# EAGLE design 608_donkey_205 (EAGLE 9.6.2)
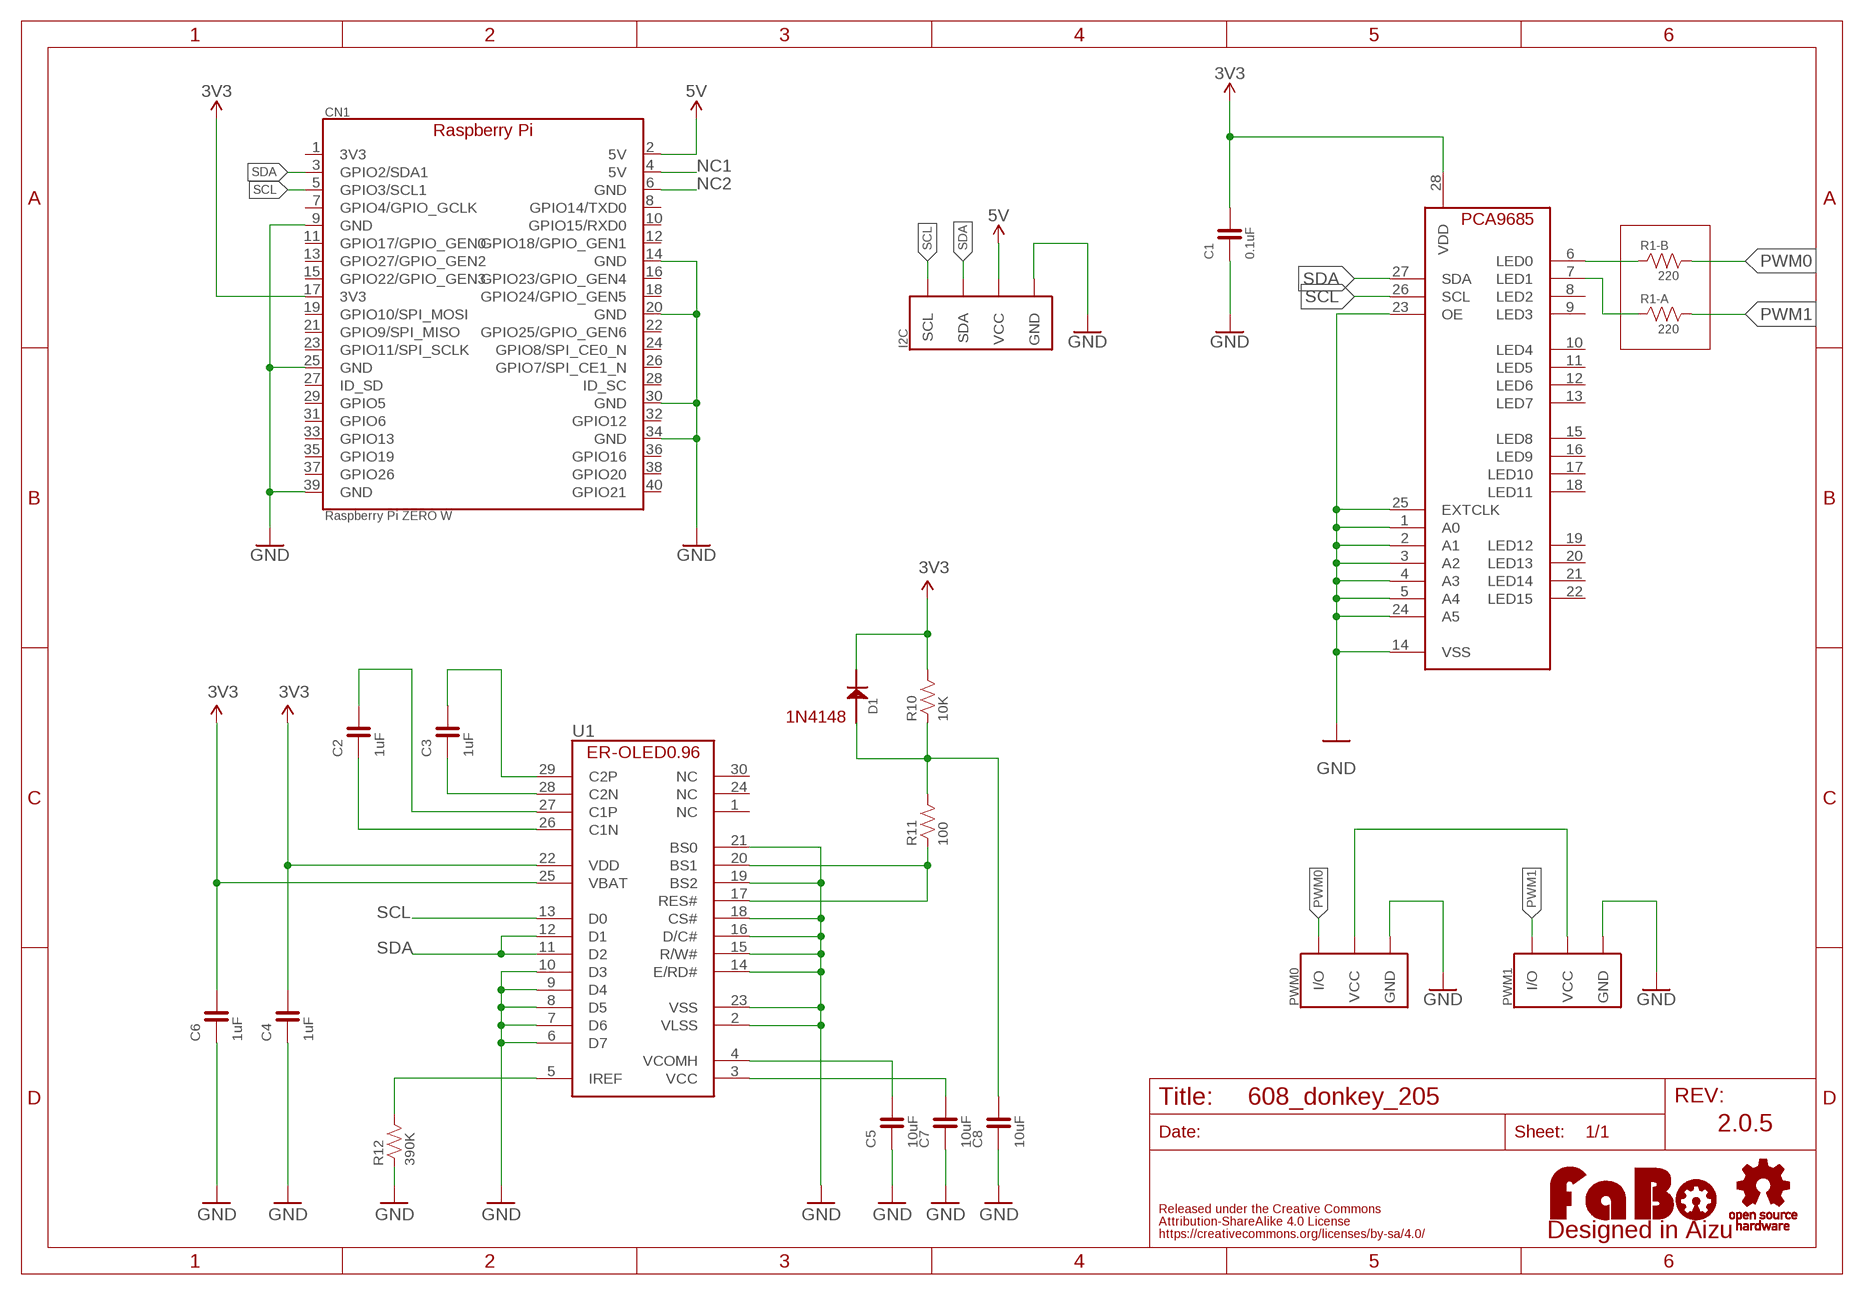
[diagram p0: schematic, sheet 1]

## Parts
C1  0.1uF  CAPACITOR-0603  [EIA0603]
C2  1uF  CAPACITOR-0603-BOTTOM  [0603-BOTTOM]
C3  1uF  CAPACITOR-0603-BOTTOM  [0603-BOTTOM]
C4  1uF  CAPACITOR-0603-BOTTOM  [0603-BOTTOM]
C5  10uF  CAPACITOR-0603-BOTTOM  [0603-BOTTOM]
C6  1uF  CAPACITOR-0603-BOTTOM  [0603-BOTTOM]
C7  10uF  CAPACITOR-0603-BOTTOM  [0603-BOTTOM]
C8  10uF  CAPACITOR-0603-BOTTOM  [0603-BOTTOM]
CN1  Raspberry Pi ZERO W  RASPBERRY_CON  [PIN_2X20_NARROW]
D1  1N4148  [1N4148W]
I2C  I2C  FABO-BRICK-I2C_SIDE_SMD_BOSS  [SM04B-PASS-1]
LOGO1  LOGO_FABO-M  [LOGO_FABO_M]
PWM0  PWM0  FABO-BRICK-3PIN_HEADER  [PIN_1X3_NARROW]
PWM1  PWM1  FABO-BRICK-3PIN_HEADER  [PIN_1X3_NARROW]
R1  220  RESISTOR_ARRAY_2  [EXBV4V]
R10  10K  RESISTOR-0603-BOTTOM  [0603-BOTTOM]
R11  100  RESISTOR-0603-BOTTOM  [0603-BOTTOM]
R12  390K  RESISTOR-0603-BOTTOM  [0603-BOTTOM]
U1  OLED0.96  ER-OLED0.96-1ER-CON30HT-1  [ER-CON30HT-1]
U$4  PCA9685_BOTTOM  [PCA9685_BOTTOM]
U$9  LOGO_OSHW-M_BOTTOM  [LOGO_OSHW_M_BOTTOM]

## Nets
3V3: C1.2 C4.2 C6.2 CN1.17(3V3) D1.CATHODE R10.2 U1.22(VDD) U1.25(VBAT) U$4.28(VDD)
5V: CN1.2(5V) I2C.3(VCC)
GND: C1.1 C4.1 C5.1 C6.1 C7.1 C8.1 CN1.9(GND) CN1.14(GND) CN1.20(GND) CN1.25(GND) CN1.30(GND) CN1.34(GND) CN1.39(GND) I2C.4(GND) PWM0.3(GND) PWM1.3(GND) R12.1 U1.2(VLSS) U1.6(D7) U1.7(D6) U1.8(D5) U1.9(D4) U1.10(D3) U1.14(E/RD#) U1.15(R/W#) U1.16(D/C#) U1.18(CS#) U1.19(BS2) U1.21(BS0) U1.23(VSS) U$4.1(A0) U$4.2(A1) U$4.3(A2) U$4.4(A3) U$4.5(A4) U$4.14(VSS) U$4.23(OE) U$4.24(A5) U$4.25(EXTCLK)
N$1: PWM0.2(VCC) PWM1.2(VCC)
N$2: R1.1 U$4.7(LED1)
N$4: R1.2 U$4.6(LED0)
N$7: C2.1 U1.26(C1N)
N$14: C2.2 U1.27(C1P)
N$19: C3.1 U1.28(C2N)
N$21: C3.2 U1.29(C2P)
N$23: R12.2 U1.5(IREF)
N$24: C5.2 U1.4(VCOMH)
N$25: C7.2 U1.3(VCC)
N$26: R11.1 U1.17(RES#) U1.20(BS1)
N$27: C8.2 D1.ANODE R10.1 R11.2
NC1: CN1.4(5V)
NC2: CN1.6(GND)
PWM0: PWM0.1(I/O) R1.3
PWM1: PWM1.1(I/O) R1.4
SCL: CN1.5(GPIO3/SCL1) I2C.1(SCL) U1.13(D0) U$4.26(SCL)
SDA: CN1.3(GPIO2/SDA1) I2C.2(SDA) U1.11(D2) U1.12(D1) U$4.27(SDA)
Unconnected: CN1.1(3V3) CN1.7(GPIO4/GPIO_GCLK) CN1.8(GPIO14/TXD0) CN1.10(GPIO15/RXD0) CN1.11(GPIO17/GPIO_GEN0) CN1.12(GPIO18/GPIO_GEN1) CN1.13(GPIO27/GPIO_GEN2) CN1.15(GPIO22/GPIO_GEN3) CN1.16(GPIO23/GPIO_GEN4) CN1.18(GPIO24/GPIO_GEN5) CN1.19(GPIO10/SPI_MOSI) CN1.21(GPIO9/SPI_MISO) CN1.22(GPIO25/GPIO_GEN6) CN1.23(GPIO11/SPI_SCLK) CN1.24(GPIO8/SPI_CE0_N) CN1.26(GPIO7/SPI_CE1_N) CN1.27(ID_SD) CN1.28(ID_SC) CN1.29(GPIO5) CN1.31(GPIO6) CN1.32(GPIO12) CN1.33(GPIO13) CN1.35(GPIO19) CN1.36(GPIO16) CN1.37(GPIO26) CN1.38(GPIO20) CN1.40(GPIO21) U1.1(NC) U1.24(NC) U1.30(NC) U$4.8(LED2) U$4.9(LED3) U$4.10(LED4) U$4.11(LED5) U$4.12(LED6) U$4.13(LED7) U$4.15(LED8) U$4.16(LED9) U$4.17(LED10) U$4.18(LED11) U$4.19(LED12) U$4.20(LED13) U$4.21(LED14) U$4.22(LED15)

## Notes on the sheet
- 1N4148
- 2.0.5

## Library data of the parts
C1 = component:CAPACITOR
C2-C8 = FaBo-Capacitor:CAPACITOR: CAPACITOR
CN1 = component:RASPBERRY_CON
D1 = FaBo-Diode:1N4148
I2C = component:FABO-BRICK-I2C
LOGO1 = component:LOGO_FABO
PWM0 PWM1 = component:FABO-BRICK-3PIN
R1 = component:RESISTOR_ARRAY_2
R10-R12 = FaBo-Resistors:RESISTOR: RESISTOR
U1 = FaBo-Display:ER-OLED0.96-1
U$4 = FaBo-Motor:PCA9685
U$9 = component:LOGO_OSHW

## Board
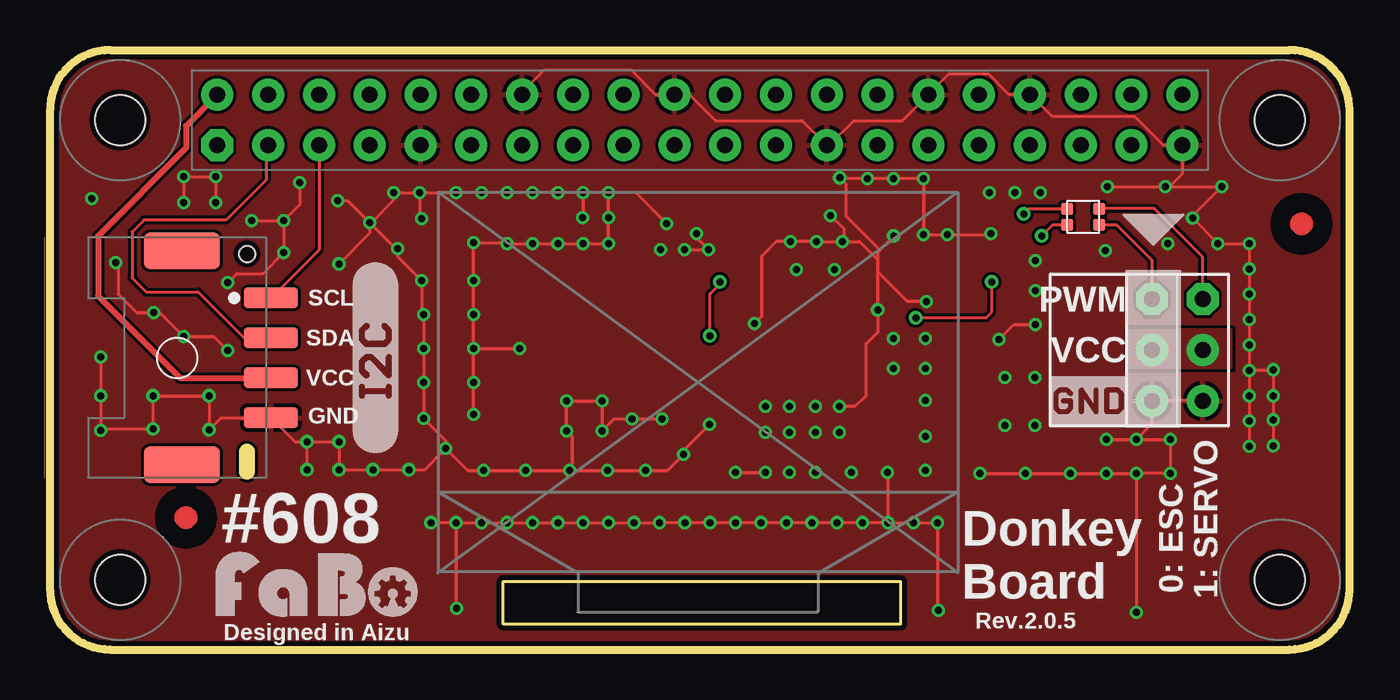
[diagram p1: board, top side]
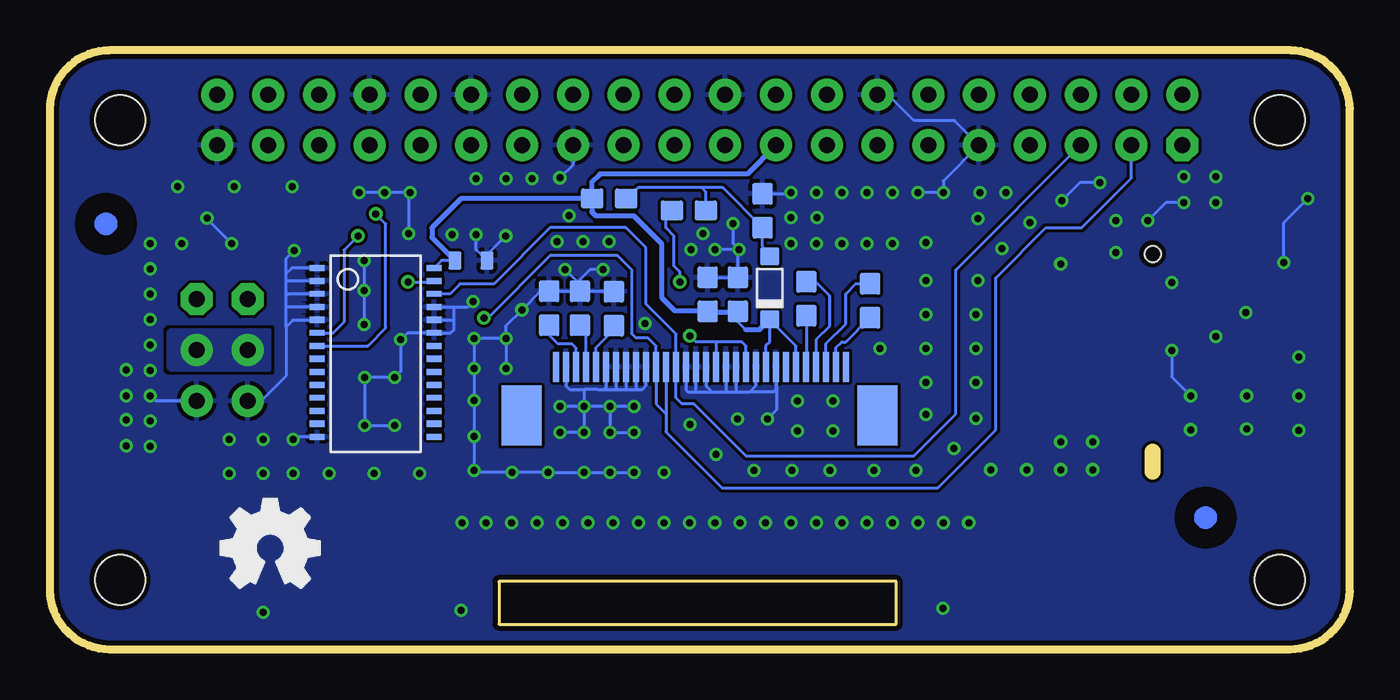
[diagram p2: board, bottom side, seen from below]

Size 65 x 30 mm. Coordinates in mm from the lower left corner, seen from the top.
Outline: 3,0 62,0 arc90 65,3 65,27 arc90 62,30 3,30 arc90 0,27 0,3 arc90 3,0
Outline: 22.67,3.41 42.54,3.41 42.54,1.27 22.67,1.27 22.67,3.41
Copper layers (1*16): Top 0.035mm / dielectric 1.6mm / Bottom 0.035mm
Design rules "PCBway": minimum track width 6mil, minimum drill 12mil, track to track 6mil, track to pad 6mil, pad to pad 6mil, via to via 6mil, smd to smd 6mil, copper to edge 10mil, drill to drill 10mil, minimum pad ring 10mil, minimum via ring 6mil, stop-mask expansion 2mil, vias tented up to drill 100mil, thermal gap 8mil
Holes 2.5 mm at 3.5,3.5 3.5,26.5 61.5,26.5 61.5,3.5
bRestrict: 14 lines

### Footprints (pad centres in the part's own frame; a part is rotated, then mirrored left to right if it is on the bottom)
EIA0603 = smd 0.65 x 0.9: 1 -0.8,0; 2 0.8,0
0603-BOTTOM = smd 1.1 x 1 bottom: 1 -0.85,0; 2 0.85,0
PIN_2X20_NARROW = drill 0.8 pad 1.6 octagon: 1 -24.13,-1.27 | drill 0.8 pad 1.6: 2 -24.13,1.27; 3 -21.59,-1.27; 4 -21.59,1.27; 5 -19.05,-1.27; 6 -19.05,1.27; 7 -16.51,-1.27; 8 -16.51,1.27; 9 -13.97,-1.27; 10 -13.97,1.27; 11 -11.43,-1.27; 12 -11.43,1.27; 13 -8.89,-1.27; 14 -8.89,1.27; 15 -6.35,-1.27; 16 -6.35,1.27; 17 -3.81,-1.27; 18 -3.81,1.27; 19 -1.27,-1.27; 20 -1.27,1.27; 21 1.27,-1.27; 22 1.27,1.27; 23 3.81,-1.27; 24 3.81,1.27; 25 6.35,-1.27; 26 6.35,1.27; 27 8.89,-1.27; 28 8.89,1.27; 29 11.43,-1.27; 30 11.43,1.27; 31 13.97,-1.27; 32 13.97,1.27; 33 16.51,-1.27; 34 16.51,1.27; 35 19.05,-1.27; 36 19.05,1.27; 37 21.59,-1.27; 38 21.59,1.27; 39 24.13,-1.27; 40 24.13,1.27
1N4148W = smd 0.9 x 0.95: ANODE 0,0; CATHODE 3.15,0
SM04B-PASS-1 = smd 1 x 2.7: 1 3,-11.85; 2 1,-11.85; 3 -1,-11.85; 4 -3,-11.85 | smd 1.8 x 3.8: P$1 5.35,-7.4; P$2 -5.35,-7.4 | hole 0.8: 5.2,-10.65
PIN_1X3_NARROW = drill 0.8 pad 1.6 octagon: 1 -2.54,0 | drill 0.8 pad 1.6: 2 0,0; 3 2.54,0
EXBV4V = smd 0.6 x 0.6: 1 -0.4,-0.8; 2 0.4,-0.8; 3 0.4,0.8; 4 -0.4,0.8
ER-CON30HT-1 = smd 0.3 x 1.5 bottom: 1 7,-0.23; 2 6.5,-0.23; 3 6,-0.23; 4 5.5,-0.23; 5 5,-0.23; 6 4.5,-0.23; 7 4,-0.23; 8 3.5,-0.23; 9 3,-0.23; 10 2.5,-0.23; 11 2,-0.23; 12 1.5,-0.23; 13 1,-0.23; 14 0.5,-0.23; 15 0,-0.23; 16 -0.5,-0.23; 17 -1,-0.23; 18 -1.5,-0.23; 19 -2,-0.23; 20 -2.5,-0.23; 21 -3,-0.23; 22 -3.5,-0.23; 23 -4,-0.23; 24 -4.5,-0.23; 25 -5,-0.23; 26 -5.5,-0.23; 27 -6,-0.23; 28 -6.5,-0.23; 29 -7,-0.23; 30 -7.5,-0.23 | smd 2 x 3 bottom: 31 -9.07,-2.67; 32 8.74,-2.67
PCA9685_BOTTOM = smd 0.3 x 0.75 bottom: 1 4.3,-2.93; 2 3.65,-2.93; 3 3,-2.93; 4 2.35,-2.93; 5 1.7,-2.93; 6 1.05,-2.93; 7 0.4,-2.93; 8 -0.25,-2.93; 9 -0.9,-2.93; 10 -1.55,-2.93; 11 -2.2,-2.93; 12 -2.85,-2.93; 13 -3.5,-2.93; 14 -4.15,-2.93; 15 -4.15,2.92; 16 -3.5,2.92; 17 -2.85,2.92; 18 -2.2,2.92; 19 -1.55,2.92; 20 -0.9,2.92; 21 -0.25,2.92; 22 0.4,2.92; 23 1.05,2.92; 24 1.7,2.92; 25 2.35,2.92; 26 3,2.92; 27 3.65,2.92; 28 4.3,2.92

### Placement (x,y rotation side)
C1  43.94,19.46 180 bottom
C2  27.17,17.56 90 top
C3  23.99,17.46 270 top
C4  30.6,17.77 270 top
C5  38.49,17.08 270 top
C6  32.11,17.77 270 top
C7  40.03,17.08 270 top
C8  29.36,21.96 270 top
CN1  32.5,26.5 0 top
D1  29,19.68 270 bottom
I2C  -0.8,14.6 90 top
LOGO1  13.34,1.27 0 top
PWM0  55.12,14.99 270 top
PWM1  57.66,14.99 270 top
R1  51.67,21.65 270 top
R10  37.03,22.57 0 top
R11  33.04,21.97 180 top
R12  36.79,17.06 270 top
U1  32.68,14.38 0 top
U$2  [LOGO_SILK_I2C]  17.45,14.6 90 top
U$3  [LOGO_SILK_GND]  50.04,11.18 0 top
U$4  48.7,14.8 90 top
U$5  [MARK_POINT_3MM]  62.2,21.3 0 bottom
U$6  [MARK_POINT_3MM]  7.2,6.6 0 bottom
U$7  [MARK_POINT_3MM]  62.6,21.3 0 top
U$8  [MARK_POINT_3MM]  6.8,6.6 0 top
U$9  53.98,5.08 0 top

### Tracks (layer width: path | path; a pad name or v marks a point on that pad's centre or on a via)
3V3
  Bottom 0.152: C1.2 45.42,19.46 U$4.28 | 30.59,16.9 C4.2 30.59,16.39 30.2,16 | C6.2 32.15,16.95 | D1.CATHODE 29,16.3 | 29,16.3 29,15.4 29.18,15.22 U1.22 | U1.25 27.68,15.18 28.8,16.3 29,16.3
  Bottom 0.254: CN1.17 30.12,23.8 37.5,23.8 37.88,23.42 R10.2 | 32.15,16.95 33.75,16.95 34.4,17.6 34.4,20.3 35.8,21.7 37.7,21.7 37.9,21.9 37.9,22.55 R10.2 | C6.2 32.09,16.9 30.59,16.9 | 30.2,16 29.53,16 D1.CATHODE | C1.2 45.9,20.62 45.9,21.1 44.43,22.57 R10.2
5V
  Top 0.305: CN1.2 6.8,26.2 6.8,25.1 2.4,20.7 2.4,17.7 6.5,13.6 I2C.3
GND  (via drill 0.35)
  Top 0.152: PWM1.3 57.61,12.5 55.17,12.5 PWM0.3 55.12,11.3 v54.34,10.52 | 41.4,18.9 v41.4,17 41.4,15.9 40.8,15.3 40.8,12.7 40.26,12.16 v39.49,12.16 | 41.4,18.9 41.4,19.5 | 41.4,19.5 41.4,19.9 41.5,20 | 41.5,20 v42.2,20.7 | 41.5,20 39.8,21.7 39.8,23.3 v39.5,23.6 39.54,23.56 v40.89,23.56 v42.19,23.56 v43.68,23.56 v43.69,23.55 v43.69,20.76 v44.89,20.76 47,20.76 v47.06,20.82 | v35.24,16.32 35.6,16.68 35.6,19.7 36.32,20.42 v37.04,20.42 v38.34,20.42 v39.64,20.42 39.7,20.42 | 39.7,20.42 40.48,20.42 41.4,19.5 | v43.84,17.42 42.88,17.42 41.4,18.9 | CN1.14 23.61,27.88 24.74,29 29.06,29 30.29,27.77 CN1.20 31.98,27.77 33.28,26.46 37.62,26.46 CN1.25 38.96,25.23 40.2,26.47 42.63,26.47 CN1.30 44.96,28.8 46.94,28.8 47.97,27.77 CN1.34 49.04,27.77 50.14,26.67 54.25,26.67 55.69,25.23 CN1.39 56.63,23.79 56,23.16 | v30.84,21.32 29.3,22.86 v27.94,22.86 | v52.89,23.16 v55.78,23.16 56,23.16 | 56,23.16 58.6,23.16 | 58.6,23.16 v58.62,23.16 | 58.6,23.16 57.15,21.71 v57.15,21.59 v58.42,20.32 v59.99,20.32 v59.99,19.05 v59.99,17.78 v59.99,16.51 v59.99,15.24 v59.99,13.97 | v59.99,13.97 v59.99,12.7 v59.99,11.43 v59.99,10.16 | v59.99,13.97 60.02,14 v61.19,14 v61.19,12.7 v61.19,11.5 v61.19,10.2 | v52.84,10.52 v54.34,10.52 | v54.34,10.52 v56.04,10.52 v56.04,8.82 v54.34,8.82 | v54.34,8.82 v54.34,1.86 | v46.52,8.82 v48.79,8.82 v51.03,8.82 v52.84,8.82 v54.34,8.82 | v47.46,15.52 48.2,16.26 v49.29,16.26 | v8.29,22.36 v8.29,23.66 v6.69,23.66 v6.69,22.36 | v3.29,19.36 3.4,19.25 3.4,17.8 4.34,16.86 v5.19,16.86 5.49,16.86 v6.69,15.66 8.19,15.66 v8.89,14.96 | v41.88,8.86 41.91,8.83 v41.91,6.35 | v41.91,6.35 v43.18,6.35 v44.38,6.35 44.38,2.02 v44.44,1.96
  Top 0.152: v41.91,6.35 v40.64,6.35 v39.37,6.35 v38.1,6.35 v36.83,6.35 v35.56,6.35 v34.29,6.35 v33.02,6.35 v31.75,6.35 v30.48,6.35 v29.21,6.35 v27.94,6.35 v26.67,6.35 v25.4,6.35 v24.13,6.35 v22.86,6.35 v21.59,6.35 v20.32,6.35 | v20.34,2.06 20.34,6.33 v20.32,6.35 | v20.32,6.35 v19.05,6.35 | v12.85,9 v12.85,10.4 | v12.85,10.4 v14.45,10.4 v14.45,9 v16.15,9 v17.95,9 18.73,9 v19.79,10.06 | v14.39,22.46 14.89,22.46 v15.99,21.36 | v15.99,21.36 16.02,21.32 | 16.02,21.32 17.29,20.06 v17.39,20.06 17.39,19.66 v18.59,18.46 18.59,16.86 v18.69,16.76 v18.69,15.06 v18.69,13.36 v18.69,11.56 19.79,10.46 v19.79,10.06 | v15.99,21.36 15.99,20.84 v14.45,19.3 | v19.79,10.06 20.89,8.96 v21.69,8.96 v23.79,8.96 v25.99,8.96 26.1,8.96 | 26.1,8.96 v27.89,8.96 v29.79,8.96 30.89,8.96 v31.69,9.76 31.69,9.96 v32.99,11.26 | 26.1,8.96 26.1,10.67 v25.84,10.93 v25.84,12.43 v27.61,12.43 v27.61,10.93 28.21,11.53 v29.11,11.53 v30.61,11.53 | v21.19,11.76 v21.19,13.36 v21.19,15.06 | v21.19,15.06 v23.49,15.06 | v21.19,15.06 v21.19,16.76 v21.19,18.46 v21.19,20.36 22.82,20.36 v22.86,20.32 v24.13,20.32 v25.4,20.32 v26.67,20.32 v27.94,20.32 v27.94,21.62 v27.94,22.86 | v27.94,22.86 v26.67,22.86 | v26.67,22.86 26.67,21.65 v26.64,21.62 | v26.67,22.86 v25.4,22.86 v24.13,22.86 v22.86,22.86 v21.59,22.86 | v18.49,22.86 v17.19,22.86 17.19,22.49 16.02,21.32 | v18.49,22.86 18.49,21.66 v18.59,21.56 | v18.49,22.86 v20.32,22.86 | v10.09,21.46 v11.69,21.46 | v11.69,21.46 v11.69,19.86 10.63,18.8 9.33,18.8 v8.89,18.36 | v2.54,14.64 v2.54,12.7 v2.54,10.96 2.61,11.03 v5.15,11.03 v5.15,12.7 v7.95,12.7 v7.95,11 8.55,11.6 I2C.4 12.25,10.4 v12.85,10.4
  Top 0.152: v31.74,20.02 v32.94,20.02 32.34,20.62 v32.34,20.82 | v12.49,23.36 12.49,22.26 v11.69,21.46 | v39.04,21.72 39.7,21.06 39.7,20.42 | v34.28,8.86 v35.78,8.86
  Bottom 0.152: PWM0.3 54.43,12.45 53.19,13.69 53.19,16.15 53.17,16.17 | 38.3,13.01 37.59,13.01 37.58,13 37.3,13 | U1.18 31.18,12.98 31.1,12.9 | 31.1,12.9 30.6,12.9 | 30.6,12.9 30,12.9 | 30,12.9 29.68,13.22 U1.21 | U1.19 30.68,12.98 30.6,12.9 | U1.16 32.18,13.18 31.9,12.9 | 31.9,12.9 31.1,12.9 | U1.14 33.18,12.98 33.1,12.9 32.7,12.9 | 32.7,12.9 32.68,12.92 U1.15 | 32.7,12.9 31.9,12.9 | 30,12.9 28.8,12.9 28.68,13.02 U1.23 28.68,14.05 28.65,14.02 28.65,11.99 v29.11,11.53 | C6.1 C4.1 30.59,19.96 v30.54,20.02 | U1.10 35.18,13.22 35.4,13 35.7,13 | 35.7,13 36.2,13 | 36.2,13 36.6,13 | U1.9 35.68,13.02 35.7,13 | U1.8 36.18,13.02 36.2,13 | U1.7 36.68,13.08 36.6,13 | R12.1 38.4,17.91 | 38.4,17.91 38.47,17.91 | v42.2,20.7 43.14,19.76 C1.1 43.69,20.01 v43.69,20.76 | CN1.25 38.85,24.25 v39.5,23.6 | U$4.25 44.8,17.15 | 44.8,17.15 44.11,17.15 v43.84,17.42 | 44.8,16.5 44.8,16 44.95,15.85 U$4.23 47.11,15.85 47.46,15.5 | 44.8,16.5 44.8,17.15 | U$4.24 44.8,16.5 | CN1.14 23.09,27.77 21.78,26.46 19.76,26.46 CN1.9 20.32,23.44 v20.32,22.86 v21.59,22.86 | U$4.5 52.84,16.5 53.17,16.17 | U$4.1 52.9,19.1 53.2,18.8 | 53.2,18.8 53.2,18.4 | 53.2,18.4 53.2,17.7 | 53.2,17.7 53.2,17.1 | 53.2,17.1 53.2,16.2 53.17,16.17 | U$4.2 53.15,18.45 53.2,18.4 | U$4.3 53.1,17.8 53.2,17.7 | U$4.4 53.15,17.15 53.2,17.1 | 38.3,13.01 v38.3,12.17 v38.29,12.16 | v38.29,12.16 v39.49,12.16 | v30.54,20.02 v31.74,20.02 | v30.84,21.32 30.84,20.32 v30.54,20.02 | C8.1 27.99,22.81 v27.94,22.86 | v57.15,21.59 57.15,21.55 v55.92,20.32 | U$4.14 52.71,10.65 v52.84,10.52 | v52.79,19.96 53.2,19.55 53.2,18.8 | v49.29,19.46 v49.29,17.96 v49.29,16.26 | v47.46,15.52 47.46,15.5 | 47.46,15.5 47.46,13.92 v47.76,13.62 v49.26,13.62 v49.26,11.22 v47.76,11.22
  Bottom 0.152: v42.2,15.56 v42.19,15.56 v42.19,14.06 | v42.2,15.56 v43.79,15.56 v43.79,14.06 v43.79,12.46 v43.79,10.66 v43.79,8.97 v43.78,8.96 43.68,8.86 v41.88,8.86 v40.08,8.86 v38.28,8.86 v36.98,8.86 v35.78,8.86 | v38.29,12.16 38.29,12.1 | 38.29,12.1 v38.29,10.86 v39.49,10.86 | 38.29,12.1 38.23,12.16 v36.99,12.16 36.99,12.1 | 36.99,12.1 v36.99,10.86 v35.79,10.86 | v35.79,12.16 36.93,12.16 36.99,12.1 | v42.2,15.56 42.2,16.2 v41.4,17 40.47,17.93 C7.1 C5.1 38.49,18.51 37.98,19.02 v37.34,19.02 | v49.53,22.86 v48.26,22.86 v46.99,22.86 47.06,22.79 v47.06,20.82 | v12.49,23.36 13.49,23.36 v14.39,22.46 | v8.29,22.36 9.19,22.36 v10.09,21.46 | v3.29,19.36 3.29,21.36 v2.09,22.56 | v8.89,14.96 8.89,13.64 v7.95,12.7 | v39.24,19.02 38.4,18.18 38.4,17.91 | U1.2 39.18,13.22 39.2,13.2 39.01,13.01 38.3,13.01 | 36.6,13 37.3,13 | U1.6 37.18,13.12 37.3,13 | PWM1.3 59.74,12.45 v59.99,12.7
  Bottom 0.254: 38.47,17.91 C5.1
  pour Top (rank 2): 0,0 64.77,0 64.77,6.35 64.77,30.48 0,30.48
  pour Bottom (rank 2): 0,0 64.77,0 64.77,30.48 0,30.48
N$1
  pour Top (no thermals): 53.98,16 59.05,16 59.05,14.1 53.98,14.1
  pour Bottom (no thermals): 54,16 59,16 59.1,15.9 59.1,14.1 59,14 54,14
N$2  (via drill 0.35)
  Top 0.152: v48.7,21.8 48.95,22.05 R1.1
  Bottom 0.152: U$4.7 49.1,15.2 48.2,16.1 48.2,21.3 v48.7,21.8
N$4  (via drill 0.35)
  Top 0.152: v49.6,20.7 50.15,21.25 R1.2
  Bottom 0.152: U$4.6 50.85,15.85 50.3,16.4 50.3,20 v49.6,20.7
N$7
  Bottom 0.152: C2.1 27.17,14.16 U1.26
N$14
  Bottom 0.152: C2.2 26.71,18.41 26,17.7 26,16.2 26.68,15.52 U1.27
N$19
  Bottom 0.152: U1.28 26.18,15.32 25.2,16.3 25.2,17.8 24.69,18.31 C3.1
N$21
  Bottom 0.152: U1.29 25.68,15.12 25.4,15.4 25.19,15.4 C3.2
N$23
  Bottom 0.152: U1.5 37.68,15.12 36.79,16.01 R12.2
N$24
  Bottom 0.152: C5.2 38.38,16.12 38.18,15.92 U1.4
N$25
  Bottom 0.152: C7.2 40,16.23 40,15.7 39.6,15.3 38.9,15.3 38.68,15.08 U1.3
N$26  (via drill 0.35)
  Top 0.152: v33,15.7 33,17.8 33.5,18.3 v33.5,18.4
  Bottom 0.152: 31.7,15.4 31.7,14.17 U1.17 | U1.20 30.18,15.18 30.4,15.4 31.7,15.4 | v33,15.7 32.7,15.4 31.7,15.4 | v33.5,18.4 33.5,18.9 33.8,19.2 33.8,20.7 34.2,21.1 34.2,21.66 R11.1
N$27
  Bottom 0.152: D1.ANODE 29,19.8 29.36,20.16 C8.2 31.35,23.1 32.4,23.1 | R11.2 32.19,22.89 32.4,23.1 | 32.4,23.1 35.6,23.1 36.13,22.57 R10.1
PWM0
  Top 0.152: R1.3 53.35,21.25 55.12,19.48 PWM0.1
PWM1
  Top 0.152: R1.4 55.25,22.05 57.66,19.64 PWM1.1
SCL
  Top 0.152: CN1.5 13.45,20 I2C.1
  Bottom 0.152: CN1.5 13.47,25.23 19.7,19 19.7,11.8 21.8,9.7 30.2,9.7 32.8,12.3 33.4,12.3 33.68,12.58 U1.13 33.68,15.78 35.2,17.3 35.2,20.1 36.2,21.1 40,21.1 42.8,18.3 44.5,18.3 45,17.8 U$4.26
SDA  (via drill 0.35)
  Top 0.152: CN1.3 10.8,25.12 10.8,23.5 8.8,21.5 4.7,21.5 4.1,20.9 4.1,18.6 4.8,17.9 7.4,17.9 9.7,15.6 I2C.2 | v43.3,16.6 46.8,16.6 47.1,16.9 v47.1,18.4
  Bottom 0.152: U1.12 34.18,11.8 | CN1.3 10.91,23.59 13.4,21.1 15.2,21.1 17.7,18.6 17.7,11 20.6,8.1 31.4,8.1 34.2,10.9 34.18,10.92 34.18,11.8 | 34.18,11.8 34.68,12.3 U1.11 34.68,15.18 35.1,15.6 35.7,15.6 35.9,15.8 35.9,19 36.61,19.71 39.99,19.71 43.1,16.6 v43.3,16.6 | v47.1,18.4 45.83,18.4 U$4.27

### Text on the board
tPlace: SCL | PWM | SDA | VCC | VCC | GND | 1: SERVO | 0: ESC | #608 | Donkey / Board | Designed in Aizu | Rev.2.0.5
tDocu: OLED